# EAGLE design 05-eagleClass-555-board-squid (EAGLE 8.1.1)
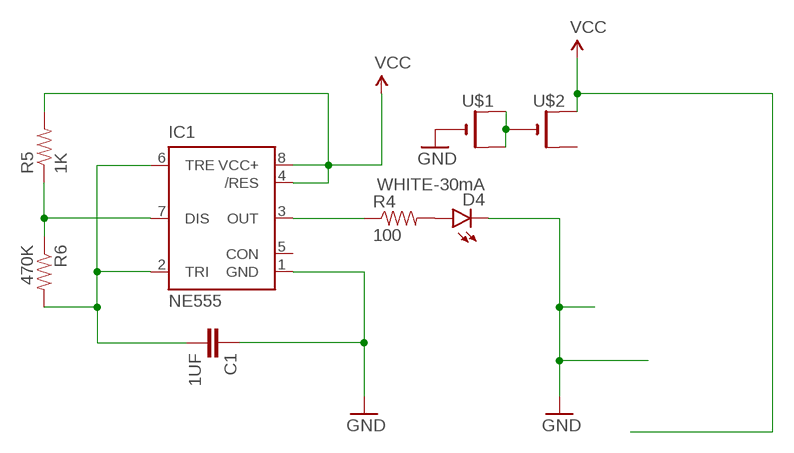
[diagram p0: schematic, sheet 1]

## Parts
C1  1UF  CAP_  [AXIAL-5MM]
D4  WHITE-30mA  LED5MM  [LED5MM]
IC1  NE555  [DIL-08]
R4  100  1KOHM-1/4W-5%(PTH)HORIZ-KIT  [AXIAL-0.3EZ]
R5  1K  1KOHM-1/4W-5%(PTH)HORIZ-KIT  [AXIAL-0.3EZ]
R6  470K  1KOHM-1/4W-5%(PTH)HORIZ-KIT  [AXIAL-0.3EZ]
U$1  CR2032THM  [CR2032-THRU]
U$2  CR2032THM  [CR2032-THRU]

## Nets
DISCHARGE: IC1.7(DIS) R5.P$1 R6.P$1
GND: C1.P$1 D4.K(C) IC1.1(GND) U$1.-
N$2: D4.A R4.P$2
N$3: IC1.2(TRI)
N$4: U$1.+1(+) U$1.+2(+1) U$2.-
OUT: IC1.3(OUT) R4.P$1
THRESHOLD: C1.P$2 IC1.6(TRE) R6.P$2
VCC: IC1.4(/RES) IC1.8(VCC+) R5.P$2 U$2.+1(+)
Unconnected: IC1.5(CON) U$2.+2(+1)

## Library data of the parts
C1 = SparkFun-Capacitors:CAP: Capacitor Standard 0603 ceramic capacitor, and 0.1" leaded capacitor.; PROD_ID: 445-8517-ND
D4 = SparkFun-LED:LED: LEDs Standard schematic elements and footprints for 5mm, 3mm, 1206, and 0603 sized LEDs. 5mm - Spark Fun Electronics SKU : COM-00529 (and others); PROD_ID: 67-2062-ND
IC1 = st-microelectronics:NE555: General purpose bipolar Timer; MF: Arrow Electronics; MPN: NE555N; OC_FARNELL: 1467742; OC_NEWARK: 89K1486; PROD_ID: 296-1857-5-ND
R4 R6 = SparkFun-Resistors:1KOHM-1/4W-5%(PTH): RES-08380; PROD_ID: RES-08380; VALUE: 1k
R5 = SparkFun-Resistors:1KOHM-1/4W-5%(PTH): RES-08380; PROD_ID: 1.0KQBK-ND; VALUE: 1k
U$1 U$2 = adafruit:CR2032

## Board
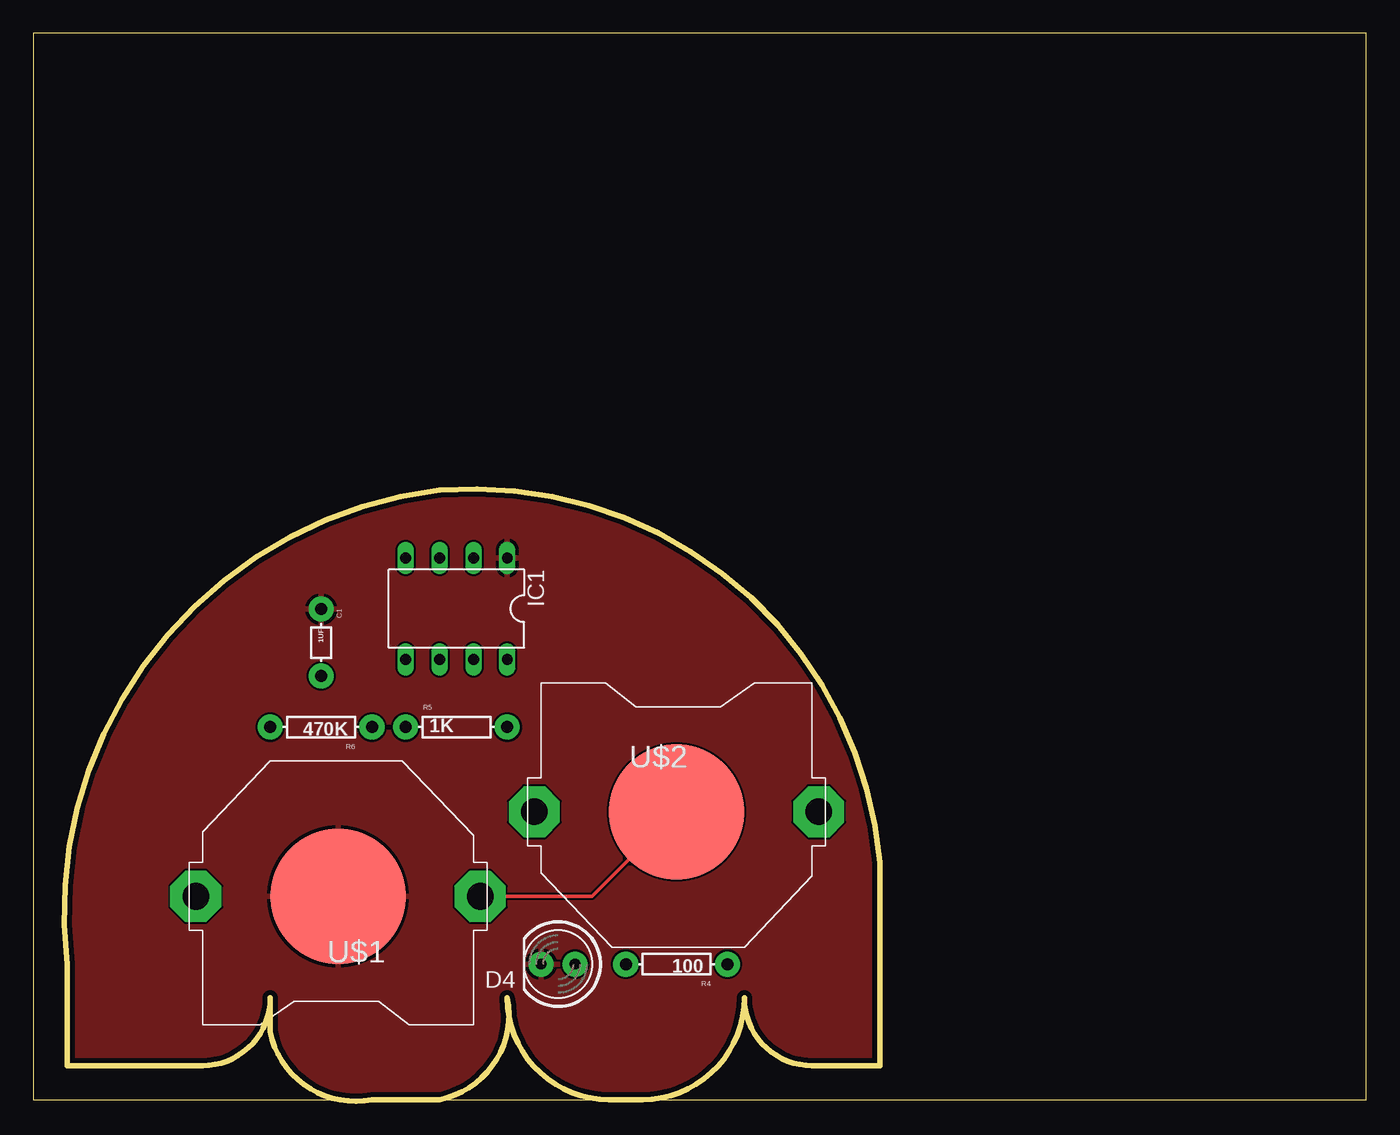
[diagram p1: board, top side]
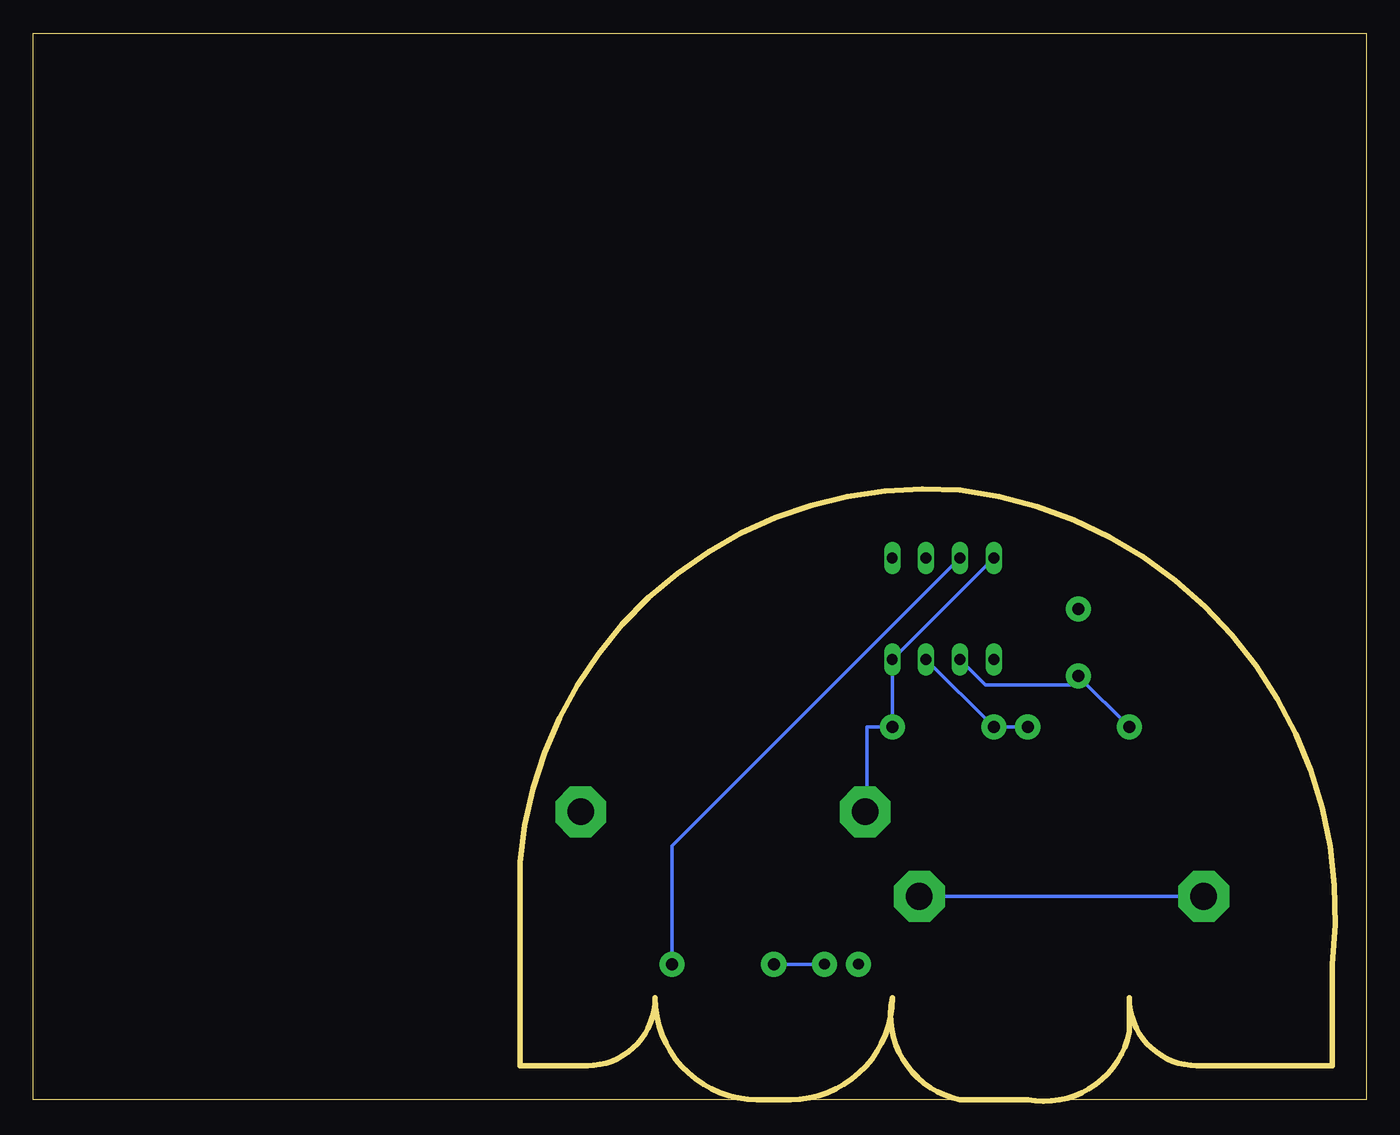
[diagram p2: board, bottom side, seen from below]

Size 100 x 80.13 mm. Coordinates in mm from the lower left corner, seen from the top.
Outline: 0,0.13 100,0.13 100,80.13 0,80.13 0,0.13
Outline: 2.54,2.67 2.54,10.29 arc-90 30.48,45.85 arc-90 63.5,17.91 63.5,2.67 58.42,2.67 arc-90 53.34,7.75 arc-90 45.72,0.13 43.18,0.13 arc-90 35.56,7.75 arc-90 30.48,0.13 25.4,0.13 arc-90 17.78,5.21 17.78,7.75 arc-90 12.7,2.67 2.54,2.67
Copper layers (1*16): Top 0.0356mm / dielectric 1.5011mm / Bottom 0.0356mm
Design rules "oshpark-2layer": minimum track width 6mil, minimum drill 13mil, track to track 6mil, track to pad 6mil, pad to pad 6mil, via to via 6mil, smd to smd 6mil, copper to edge 15mil, drill to drill 6mil, minimum pad ring 7mil, minimum via ring 7mil, stop-mask expansion 2.5mil, vias tented up to drill 0mil, thermal gap 10mil

### Footprints (pad centres in the part's own frame; a part is rotated, then mirrored left to right if it is on the bottom)
AXIAL-5MM = drill 0.9 pad 1.88: P$1 -2.5,0; P$2 2.5,0
LED5MM = drill 0.813 pad 1.88: A -1.27,0; K 1.27,0
DIL-08 = drill 0.813 long: 1 -3.81,-3.81; 2 -1.27,-3.81; 3 1.27,-3.81; 4 3.81,-3.81; 5 3.81,3.81; 6 1.27,3.81; 7 -1.27,3.81; 8 -3.81,3.81
AXIAL-0.3EZ = drill 0.9 pad 1.88: P$1 -3.81,0; P$2 3.81,0
CR2032-THRU = drill 2 pad 3.81 octagon: +1 -10.668,0; +2 10.668,0 | smd 10.16 x 10.16: - 0,0

### Placement (x,y rotation side)
C1  21.59,34.42 270 top
D4  39.37,10.29 180 top
IC1  31.75,36.96 180 top
R4  48.26,10.29 180 top
R5  31.75,28.07 0 top
R6  21.59,28.07 180 top
U$1  22.86,15.37 180 top
U$2  48.26,21.72 0 top

### Tracks (layer width: path | path; a pad name or v marks a point on that pad's centre or on a via)
DISCHARGE
  Bottom 0.254: IC1.7 R5.P$1 R6.P$1
GND
  pour Top: 2.54,2.67 0,10.29 arc-90 33.02,45.85 arc-90 63.5,17.91 63.5,2.67 55.88,2.67 arc-90 53.34,5.21 arc-90 48.26,0.13 40.64,0.13 arc-90 35.56,5.21 arc-90 30.48,0.13 22.86,0.13 arc-90 17.78,5.21 arc-45 11.65,2.67
N$2
  Bottom 0.254: R4.P$2 D4.A
N$4
  Top 0.254: U$2.- 41.91,15.37 U$1.+1
  Bottom 0.254: U$1.+1 U$1.+2
OUT
  Bottom 0.254: IC1.3 52.07,19.18 R4.P$1
THRESHOLD
  Bottom 0.254: IC1.6 28.57,31.24 22.23,31.24 21.59,31.88 | 21.59,31.88 R6.P$2 | 21.59,31.88 C1.P$2
VCC
  Bottom 0.254: IC1.4 IC1.8 R5.P$2 37.47,28.07 37.47,21.72 U$2.+1

### Text on the board
Dimension: /Users/adelleli/Dropbox (UX Team)/ADELLE-MATT-INTEL/UVicorns/class-materials/Unicorn.BMP
201bmp: /Users/adelleli/Dropbox (UX Team)/ADELLE-MATT-INTEL/UVicorns/class-materials/Unicorn.BMP